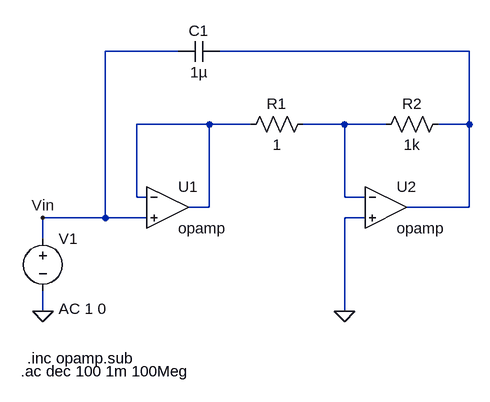
[diagram p0: schematic ejer3c.asc]
ejer3c.asc, the LTspice schematic file:
Version 4
SHEET 1 880 680
WIRE 192 -112 80 -112
WIRE 640 -112 256 -112
WIRE 240 0 128 0
WIRE 304 0 240 0
WIRE 448 0 384 0
WIRE 512 0 448 0
WIRE 640 0 640 -112
WIRE 640 0 592 0
WIRE 128 112 128 0
WIRE 144 112 128 112
WIRE 448 112 448 0
WIRE 480 112 448 112
WIRE 240 128 240 0
WIRE 240 128 208 128
WIRE 640 128 640 0
WIRE 640 128 544 128
WIRE 80 144 80 -112
WIRE 80 144 -16 144
WIRE 144 144 80 144
WIRE 480 144 448 144
WIRE -16 176 -16 144
WIRE -16 288 -16 256
WIRE 448 288 448 144
FLAG 448 288 0
FLAG -16 288 0
FLAG -16 144 Vin
SYMBOL OpAmps\\opamp 176 64 R0
SYMATTR InstName U1
SYMBOL voltage -16 160 R0
WINDOW 123 24 124 Left 2
WINDOW 39 0 0 Left 0
SYMATTR InstName V1
SYMATTR Value ""
SYMATTR Value2 AC 1 0
SYMBOL OpAmps\\opamp 512 64 R0
SYMATTR InstName U2
SYMBOL res 400 -16 R90
WINDOW 0 0 56 VBottom 2
WINDOW 3 32 56 VTop 2
SYMATTR InstName R1
SYMATTR Value 1
SYMBOL res 608 -16 R90
WINDOW 0 0 56 VBottom 2
WINDOW 3 32 56 VTop 2
SYMATTR InstName R2
SYMATTR Value 1k
SYMBOL cap 256 -128 R90
WINDOW 0 0 32 VBottom 2
WINDOW 3 32 32 VTop 2
SYMATTR InstName C1
SYMATTR Value 1µ
TEXT -40 360 Left 2 !.inc opamp.sub
TEXT -50 380 Left 2 !.ac dec 100 1m 100Meg

The netlist it stands for:
* ejer3c.asc
XU1 N002 Vin N002 opamp Aol=100K GBW=10Meg  ; pins invin noninvin out
V1 Vin 0 AC 1 0
XU2 N003 0 N001 opamp Aol=100K GBW=10Meg  ; pins invin noninvin out
R1 N003 N002 1
R2 N001 N003 1k
C1 N001 Vin 1µ
.inc opamp.sub
.ac dec 100 1m 100Meg
.backanno
.end